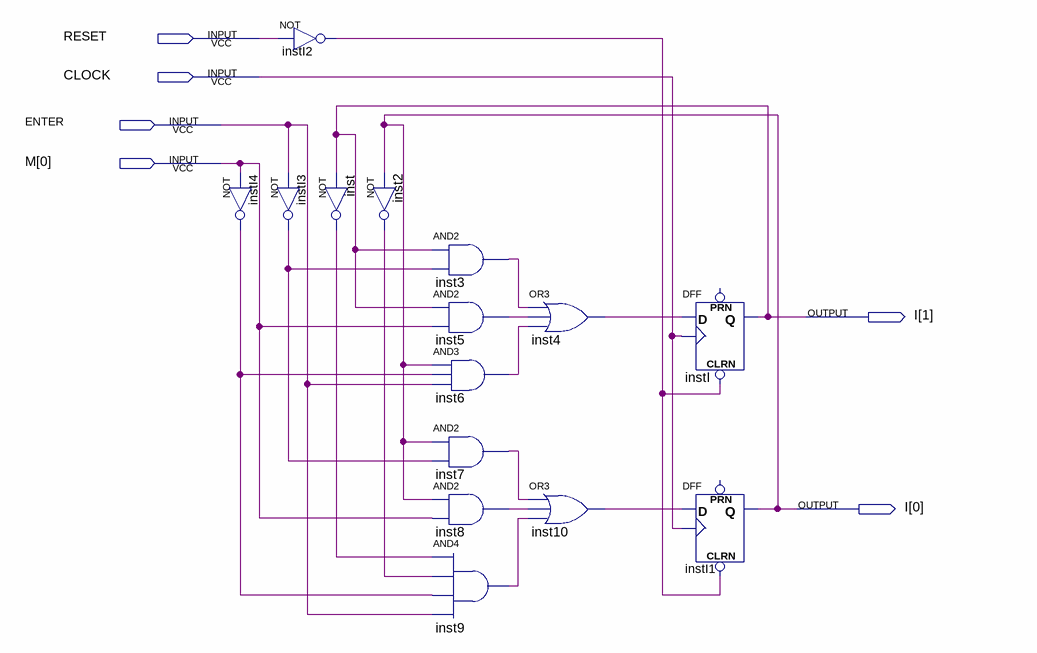
[diagram p0: schematic sheet]
// Quartus schematic Insercao.bdf as structural Verilog: 15 symbols, 6 pins
module Insercao (
  input  RESET,
  input  CLOCK,
  input  ENTER,
  input  [0:0] M,
  output [1:0] I
);

  wire inst2_out, inst3_out, inst4_out, inst5_out, inst6_out, inst7_out, inst8_out, inst9_out, inst10_out,
       inst_out, instI2_out, instI3_out, instI4_out;

  not instI3 (instI3_out, ENTER);
  not instI4 (instI4_out, M[0]);
  not instI2 (instI2_out, RESET);
  not inst (inst_out, I[1]);
  not inst2 (inst2_out, I[0]);
  and inst3 (inst3_out, I[1], instI3_out);
  and inst5 (inst5_out, I[1], M[0]);
  and inst6 (inst6_out, I[0], instI4_out, ENTER);
  and inst7 (inst7_out, I[0], instI3_out);
  and inst8 (inst8_out, I[0], M[0]);
  and inst9 (inst9_out, inst_out, inst2_out, instI4_out, ENTER);
  or inst4 (inst4_out, inst3_out, inst5_out, inst6_out);
  or inst10 (inst10_out, inst7_out, inst8_out, inst9_out);
  DFF instI (.CLRN(instI2_out), .CLK(CLOCK), .D(inst4_out), .Q(I[1]));  // open: PRN
  DFF instI1 (.CLRN(instI2_out), .CLK(CLOCK), .D(inst10_out), .Q(I[0]));  // open: PRN
endmodule
